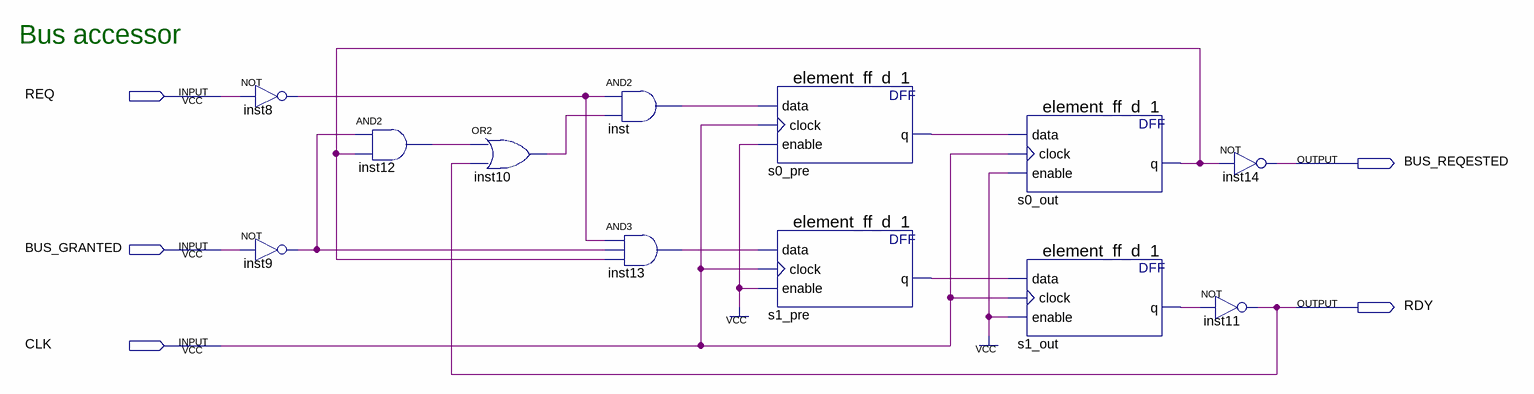
[diagram p0: schematic sheet]
// Quartus schematic block-bus-accessor.bdf as structural Verilog: 12 symbols, 5 pins
module \block-bus-accessor  (
  input  REQ,
  input  BUS_GRANTED,
  input  CLK,
  output BUS_REQESTED,
  output RDY
);

  wire inst8_out, inst9_out, inst10_out, inst12_out, inst13_out, inst_out, s0_out_q, s0_pre_q, s1_out_q,
       s1_pre_q;

  not inst8 (inst8_out, REQ);
  not inst9 (inst9_out, BUS_GRANTED);
  and inst12 (inst12_out, inst9_out, s0_out_q);
  or inst10 (inst10_out, inst12_out, RDY);
  and inst (inst_out, inst8_out, inst10_out);
  and inst13 (inst13_out, inst8_out, inst9_out, s0_out_q);
  element_ff_d_1 s0_pre (.data(inst_out), .clock(CLK), .enable(1'b1), .q(s0_pre_q));
  element_ff_d_1 s1_pre (.data(inst13_out), .clock(CLK), .enable(1'b1), .q(s1_pre_q));
  element_ff_d_1 s0_out (.data(s0_pre_q), .clock(CLK), .enable(1'b1), .q(s0_out_q));
  element_ff_d_1 s1_out (.data(s1_pre_q), .clock(CLK), .enable(1'b1), .q(s1_out_q));
  not inst14 (BUS_REQESTED, s0_out_q);
  not inst11 (RDY, s1_out_q);

  // Notes on the sheet:
  //   Bus accessor
endmodule
